# Altium schematic sheet Femto.SchDoc: Femto - RP2040 Carrier Board
size B; DocumentNumber: 1; SheetNumber: 1; SheetTotal: 1; PageSize: B; Designators: 1-99
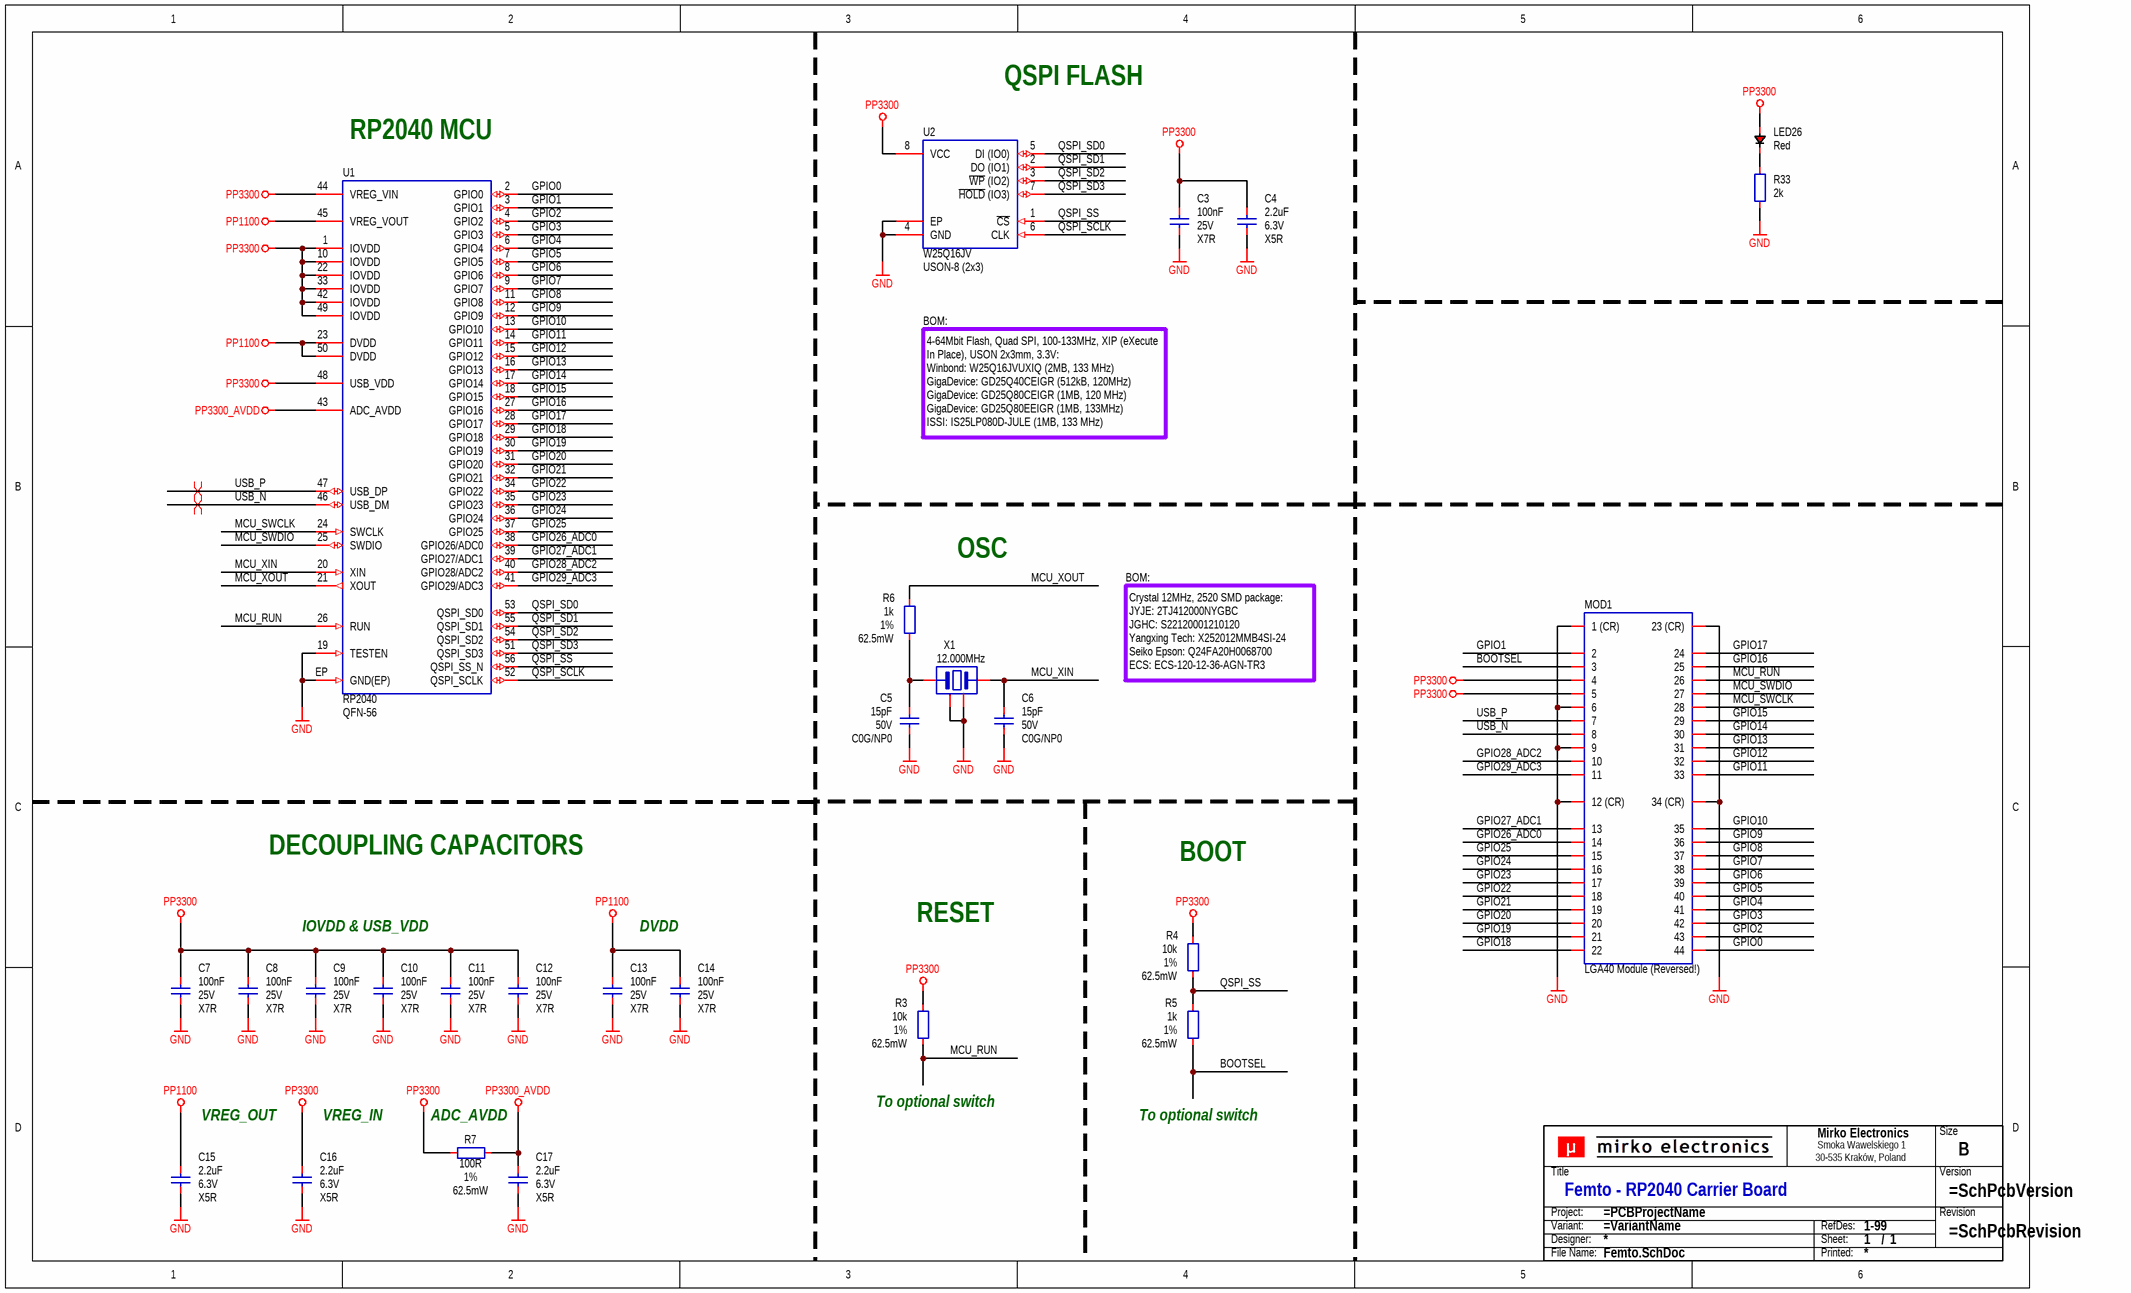
[diagram p0: Femto.SchDoc]

## Parts
C3  100nF  Voltage Rating: 25V  Dielectric: X7R  [CAP_0402_R]
C4  2.2uF  Voltage Rating: 6.3V  Dielectric: X5R  [CAP_0402_R]
C5  15pF  Voltage Rating: 50V  Dielectric: C0G/NP0  [CAP_0402_R]
C6  15pF  Voltage Rating: 50V  Dielectric: C0G/NP0  [CAP_0402_R]
C7  100nF  Voltage Rating: 25V  Dielectric: X7R  [CAP_0402_R]
C8  100nF  Voltage Rating: 25V  Dielectric: X7R  [CAP_0402_R]
C9  100nF  Voltage Rating: 25V  Dielectric: X7R  [CAP_0402_R]
C10  100nF  Voltage Rating: 25V  Dielectric: X7R  [CAP_0402_R]
C11  100nF  Voltage Rating: 25V  Dielectric: X7R  [CAP_0402_R]
C12  100nF  Voltage Rating: 25V  Dielectric: X7R  [CAP_0402_R]
C13  100nF  Voltage Rating: 25V  Dielectric: X7R  [CAP_0402_R]
C14  100nF  Voltage Rating: 25V  Dielectric: X7R  [CAP_0402_R]
C15  2.2uF  Voltage Rating: 6.3V  Dielectric: X5R  [CAP_0402_R]
C16  2.2uF  Voltage Rating: 6.3V  Dielectric: X5R  [CAP_0402_R]
C17  2.2uF  Voltage Rating: 6.3V  Dielectric: X5R  [CAP_0402_R]
LED26  Red  [LED_0402_R]
MOD1  LGA40 Module (Reversed!)  [PCB_LGA40_120X120_P100_REV]  (no BOM)
R3  10k  Tolerance: 1%  Power Rating: 62.5mW  [RES_0402_R]
R4  10k  Tolerance: 1%  Power Rating: 62.5mW  [RES_0402_R]
R5  1k  Tolerance: 1%  Power Rating: 62.5mW  [RES_0402_R]
R6  1k  Tolerance: 1%  Power Rating: 62.5mW  [RES_0402_R]
R7  100R  Tolerance: 1%  Power Rating: 62.5mW  [RES_0402_R]
R33  2k  [RES_0402_R]
TB?  Title block  (value not drawn)  (graphical)
U1  RP2040  Package (Case): QFN-56  [ICC_QFN56_700X700X90_P40_EP_RP2040]
U2  W25Q16JV  Package: USON-8 (2x3)  [ICC_USON8_200X300X55P50_EP]
X1  12.000MHz  [OSC_2520_4P_250X200H50_R]

## Nets
GND: C3.1 C4.1 C5.1 C6.1 C7.1 C8.1 C9.1 C10.1 C11.1 C12.1 C13.1 C14.1 C15.1 C16.1 C17.1 MOD1.1(1_(CR)) MOD1.6 MOD1.9 MOD1.12(12_(CR)) MOD1.23(23_(CR)) MOD1.34(34_(CR)) R33.1 U1.19(TESTEN) U1.EP(GND(EP)) U2.4(GND) U2.EP X1.2 X1.4
PP1100: C13.2 C14.2 C15.2 U1.23(DVDD) U1.45(VREG_VOUT) U1.50(DVDD)
PP3300: C3.2 C4.2 C7.2 C8.2 C9.2 C10.2 C11.2 C12.2 C16.2 LED26.2 MOD1.4 MOD1.5 R3.2 R4.2 R7.2 U1.1(IOVDD) U1.10(IOVDD) U1.22(IOVDD) U1.33(IOVDD) U1.42(IOVDD) U1.44(VREG_VIN) U1.48(USB_VDD) U1.49(IOVDD) U2.8(VCC)
PP3300_AVDD: C17.2 R7.1 U1.43(ADC_AVDD)
BOOTSEL: MOD1.3 R5.1
GPIO0: MOD1.44 U1.2(GPIO0)
GPIO1: MOD1.2 U1.3(GPIO1)
GPIO2: MOD1.43 U1.4(GPIO2)
GPIO3: MOD1.42 U1.5(GPIO3)
GPIO4: MOD1.41 U1.6(GPIO4)
GPIO5: MOD1.40 U1.7(GPIO5)
GPIO6: MOD1.39 U1.8(GPIO6)
GPIO7: MOD1.38 U1.9(GPIO7)
GPIO8: MOD1.37 U1.11(GPIO8)
GPIO9: MOD1.36 U1.12(GPIO9)
GPIO10: MOD1.35 U1.13(GPIO10)
GPIO11: MOD1.33 U1.14(GPIO11)
GPIO12: MOD1.32 U1.15(GPIO12)
GPIO13: MOD1.31 U1.16(GPIO13)
GPIO14: MOD1.30 U1.17(GPIO14)
GPIO15: MOD1.29 U1.18(GPIO15)
GPIO16: MOD1.25 U1.27(GPIO16)
GPIO17: MOD1.24 U1.28(GPIO17)
GPIO18: MOD1.22 U1.29(GPIO18)
GPIO19: MOD1.21 U1.30(GPIO19)
GPIO20: MOD1.20 U1.31(GPIO20)
GPIO21: MOD1.19 U1.32(GPIO21)
GPIO22: MOD1.18 U1.34(GPIO22)
GPIO23: MOD1.17 U1.35(GPIO23)
GPIO24: MOD1.16 U1.36(GPIO24)
GPIO25: MOD1.15 U1.37(GPIO25)
GPIO26_ADC0: MOD1.14 U1.38(GPIO26/ADC0)
GPIO27_ADC1: MOD1.13 U1.39(GPIO27/ADC1)
GPIO28_ADC2: MOD1.10 U1.40(GPIO28/ADC2)
GPIO29_ADC3: MOD1.11 U1.41(GPIO29/ADC3)
MCU_RUN: MOD1.26 R3.1 U1.26(RUN)
MCU_SWCLK: MOD1.28 U1.24(SWCLK)
MCU_SWDIO: MOD1.27 U1.25(SWDIO)
MCU_XIN: C6.2 U1.20(XIN) X1.3
MCU_XOUT: R6.1 U1.21(XOUT)
QSPI_SCLK: U1.52(QSPI_SCLK) U2.6(CLK)
QSPI_SD0: U1.53(QSPI_SD0) U2.5(DI_(IO0))
QSPI_SD1: U1.55(QSPI_SD1) U2.2(DO_(IO1))
QSPI_SD2: U1.54(QSPI_SD2) U2.3(~{WP}_(IO2))
QSPI_SD3: U1.51(QSPI_SD3) U2.7(~{HOLD}_(IO3))
QSPI_SS: R4.1 R5.2 U1.56(QSPI_SS_N) U2.1(~{CS})
USB_N: MOD1.8 U1.46(USB_DM)
USB_P: MOD1.7 U1.47(USB_DP)
NetC5_2: C5.2 R6.2 X1.1
NetLED26_1: LED26.1 R33.2

## Layout directives
differential pair: USB_N, USB_P

## Notes on the sheet
- QSPI FLASH
- (near U1) RP2040 MCU
- BOM:
- 4-64Mbit Flash, Quad SPI, 100-133MHz, XIP (eXecute In Place), USON 2x3mm, 3.3V:
  Winbond: W25Q16JVUXIQ (2MB, 133 MHz)
  GigaDevice: GD25Q40CEIGR (512kB, 120MHz)
  GigaDevice: GD25Q80CEIGR (1MB, 120 MHz)
  GigaDevice: GD25Q80EEIGR (1MB, 133MHz)
  ISSI: IS25LP080D-JULE (1MB, 133 MHz)
- OSC
- Crystal 12MHz, 2520 SMD package:
  JYJE: 2TJ412000NYGBC
  JGHC: S22120001210120
  Yangxing Tech: X252012MMB4SI-24
  Seiko Epson: Q24FA20H0068700
  ECS: ECS-120-12-36-AGN-TR3
- DECOUPLING CAPACITORS
- BOOT
- IOVDD & USB_VDD
- DVDD
- RESET
- To optional switch
- VREG_OUT
- VREG_IN
- (near R7) ADC_AVDD
- (in symbol SCH_TITLE_BLOCK_V1) Mirko Electronics; Size; Smoka Wawelskiego 1; 30-535 Kraków, Poland; Title; Version; Project:; Revision; Variant:; RefDes:; Designer:; Sheet:; /; File Name:; Printed:

## Library data of the parts
C3 C7-C14 = CAP-0026: Capacitor; MLCC; GENERIC; TBD; TBD; TBD; TBD; SMD; 0402 (1005);; Manufacturer: Samsung Electro-Mechanics; MPN: CL05B104KA5NNNC; Component Body: 1.00 x 0.50mm; ID: CAP-0026; Component Type: Capacitor; Component Subtype: MLCC; Value: 100nF; Mounting Type: SMD; Package (Case): 0402 (1005); Component Height: TBD; Packaging Type: TBD; ROHS Status: TBD; Operating Temperature: TBD; Capacitance: 100nF; Tolerance: TBD; Features: TBD; Supplier 1: LCSC; Supplier 2: Farnell; Supplier Part Number 1: C155422; Supplier Part Number 2: 2496772; Supplier 3: Mouser; Supplier Part Number 3: 187-CL05B104KA5NNNC
C4 C15-C17 = CAP-0026: Capacitor; MLCC; GENERIC; TBD; TBD; TBD; TBD; SMD; 0402 (1005);; Manufacturer: Samsung Electro-Mechanics; MPN: CL05A225MQ5NNNC; Component Body: 1.00 x 0.50mm; ID: CAP-0026; Component Type: Capacitor; Component Subtype: MLCC; Value: 2.2uF; Mounting Type: SMD; Package (Case): 0402 (1005); Component Height: TBD; Packaging Type: TBD; ROHS Status: TBD; Operating Temperature: TBD; Capacitance: 2.2uF; Tolerance: TBD; Features: TBD; Supplier 1: LCSC; Supplier 2: Farnell; Supplier Part Number 1: C107371; Supplier Part Number 2: 3013335; Supplier 3: Mouser; Supplier Part Number 3: 187-CL05A225MQ5NNNC
C5 C6 = CAP-0026: Capacitor; MLCC; GENERIC; TBD; TBD; TBD; TBD; SMD; 0402 (1005);; Manufacturer: KEMET Corporation; MPN: C0402C150J5GACTU; Component Body: 1.00 x 0.50mm; ID: CAP-0026; Component Type: Capacitor; Component Subtype: MLCC; Value: 15pF; Mounting Type: SMD; Package (Case): 0402 (1005); Component Height: TBD; Packaging Type: TBD; ROHS Status: TBD; Operating Temperature: TBD; Capacitance: 15pF; Tolerance: TBD; Features: TBD; Supplier 1: LCSC; Supplier 2: Farnell; Supplier Part Number 1: C106997; Supplier Part Number 2: 1414577; Supplier 3: Mouser; Supplier Part Number 3: 80-C0402C150J5G
LED26 = DIO_LED_RED: Diode; LED; Red;; Component Subtype: LED Diode; Package (Case): 0402 (1005); Value: Red; Component Type: LED; Mounting Type: SMD; Supplier 1: LCSC; Supplier 2: Farnell; Supplier Part Number 1: C965790; Supplier Part Number 2: 2900754; Supplier 3: Mouser; Supplier Part Number 3: 710-150040RS73240
MOD1 = PCB_LGA40_P100: PCB Module; LGA40; Pitch 1mm;; Value: LGA40 Module (Reversed!)
R3 R4 = RES-0004: Resistor; Thick Film; 10k; 1%; 62.5mW; 100PPM; 50V; Standard; SMD; 0402 (1005);; Manufacturer: Yageo Corporation; MPN: RC0402FR-0710KL; Component Body: 1.00 x 0.50mm; Packaging Type: Tape & Reel; ID: RES-0004; Component Type: Resistor; Component Subtype: Thick Film; Value: 10k; Mounting Type: SMD; Package (Case): 0402 (1005); Component Height: 0.35mm; ROHS Status: RoHS Compliant; Operating Temperature: -55°C to +155°C; Resistance: 10k; TCR: 100PPM; Voltage Rating: 50V; Features: Standard; Supplier 1: LCSC; Supplier 2: Farnell; Supplier Part Number 1: C60490; Supplier Part Number 2: 9239359; Supplier 3: Mouser; Supplier Part Number 3: 603-RC0402FR-0710KL
R5 R6 = RES-0003: Resistor; Thick Film; 1k; 1%; 62.5mW; 100PPM; 50V; Standard; SMD; 0402 (1005);; Manufacturer: Yageo Corporation; MPN: RC0402FR-071KL; Component Body: 1.00 x 0.50mm; Packaging Type: Tape & Reel; ID: RES-0003; Component Type: Resistor; Component Subtype: Thick Film; Value: 1k; Mounting Type: SMD; Package (Case): 0402 (1005); Component Height: 0.35mm; ROHS Status: RoHS Compliant; Operating Temperature: -55°C to +155°C; Resistance: 1k; TCR: 100PPM; Voltage Rating: 50V; Features: Standard; Supplier 1: LCSC; Supplier 2: Farnell; Supplier Part Number 1: C106235; Supplier Part Number 2: 9239235; Supplier 3: Mouser; Supplier Part Number 3: 603-RC0402FR-071KL
R7 = RES-0002: Resistor; Thick Film; 100R; 1%; 62.5mW; 100PPM; 50V; Standard; SMD; 0402 (1005);; Manufacturer: Yageo Corporation; MPN: RC0402FR-07100RL; Component Body: 1.00 x 0.50mm; Packaging Type: Tape & Reel; ID: RES-0002; Component Type: Resistor; Component Subtype: Thick Film; Value: 100R; Mounting Type: SMD; Package (Case): 0402 (1005); Component Height: 0.35mm; ROHS Status: RoHS Compliant; Operating Temperature: -55°C to +155°C; Resistance: 100R; TCR: 100PPM; Voltage Rating: 50V; Features: Standard; Supplier 1: LCSC; Supplier 2: Farnell; Supplier Part Number 1: C106232; Supplier Part Number 2: 2421888; Supplier 3: Mouser; Supplier Part Number 3: 603-RC0402FR-07100RL
R33 = RES-0058: Resistor; Thick Film; GENERIC; TBD; TBD; TBD; TBD; TBD; SMD; 0402 (1005);; Manufacturer: Yageo Corporation; MPN: RC0402FR-072KP; Component Body: 1.00 x 0.50mm; Tolerance: 1%; Power Rating: 62.5mW; Voltage Rating: 50V; ID: RES-0058; Component Type: Resistor; Component Subtype: Thick Film; Value: 2k; Mounting Type: SMD; Package (Case): 0402 (1005); Component Height: TBD; Packaging Type: TBD; ROHS Status: TBD; Operating Temperature: TBD; Resistance: 2k; TCR: TBD; Features: TBD; Supplier 1: LCSC; Supplier 2: Farnell; Supplier Part Number 1: C60488; Supplier Part Number 2: 1458757; Supplier 3: Mouser; Supplier Part Number 3: 603-RC0402FR-072KL
TB? = SCH_TITLE_BLOCK_V1: Component Type: Title block; Manufacturer: -; Mounting Type: Non component; MPN: -; Operating Temperature: -; Package: -; Specification: Title block; Value: Title block; Replacement: -; System: ?
U1 = ICC_RPI_RP2040_QFN56: IC; MCU;; Manufacturer: Raspberry Pi; Component Subtype: MCU; Component Type: IC; Mounting Type: SMD; MPN: RP2040; Value: RP2040; Supplier 1: LCSC; Supplier Part Number 1: C2040; Supplier 2: Farnell; Supplier Part Number 2: 3766082; Supplier 3: Mouser; Supplier Part Number 3: 358-RP2040CHIP-7-500
U2 = ICC_WBD_W25Q64_SOIC_WSON_USON: ICC; Manufacturer: Winbond Electronics; MPN: W25Q16JVUXIQ; Specification: Serial Flash memory, 16Mbit, standard-, dual-, Quad- SPI interface, 133MHz, USON 2x3mm package; Component Type: IC; Mounting Type: SMD; Operating Temperature: -40°C to +85°C; Value: W25Q16JV; Supplier 1: LCSC; Supplier 2: Farnell; Supplier 3: Mouser; Supplier Part Number 1: C2843335; Supplier Part Number 3: 454-W25Q16JVUXIQTR
X1 = OSC_XTL_P4: Oscillator; Crystal;; Manufacturer: ECS; MPN: ECS-120-12-36-AGN-TR3; Value: 12.000MHz; Component Subtype: Crystal; Component Type: Crystal; Mounting Type: SMD; Package (Case): SMD 2520; Supplier 1: LCSC; Supplier 2: Farnell; Supplier Part Number 1: C2149205; Supplier Part Number 2: 2849406; Supplier 3: Mouser; Supplier Part Number 3: 520-120-12-36AGN-TR3